# Altium schematic sheet STM32L152.SchDoc
size A4
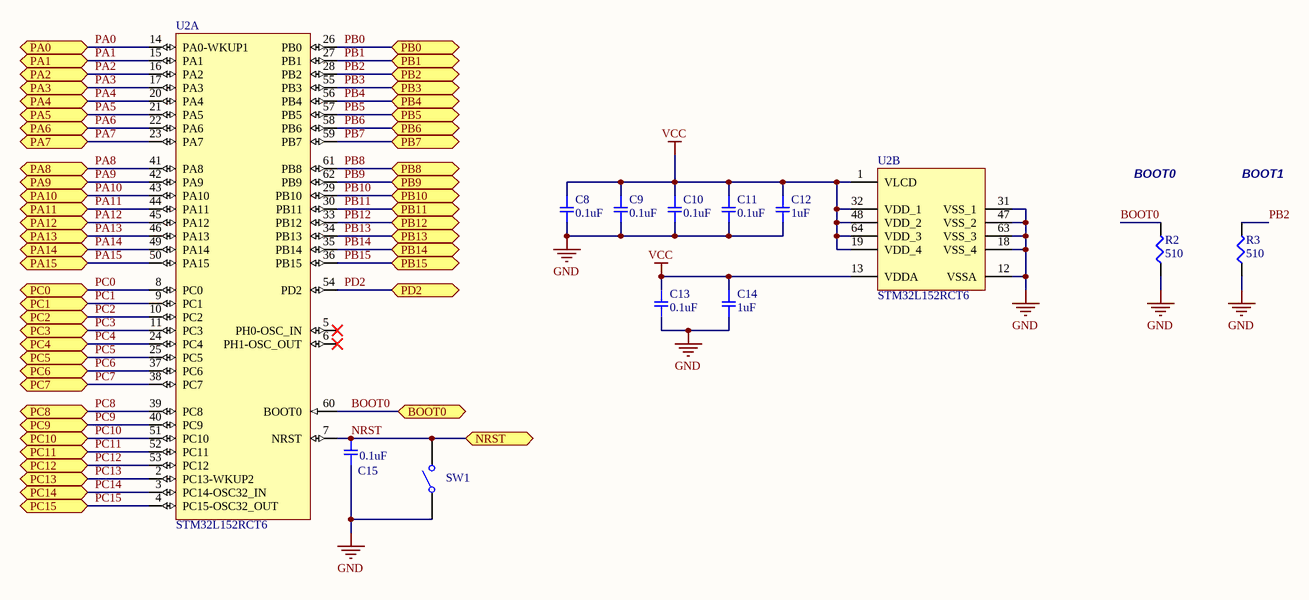
[diagram p0: STM32L152.SchDoc]

## Parts
C8  0.1uF  [SMD-0805C]
C9  0.1uF  [SMD-0805C]
C10  0.1uF  [SMD-0805C]
C11  0.1uF  [SMD-0805C]
C12  1uF  [SMD-0805C]
C13  0.1uF  [SMD-0805C]
C14  1uF  [SMD-0805C]
C15  0.1uF  [SMD-0805C]
R2  510  [SMD-0805-RES]
R3  510  [SMD-0805-RES]
SW1  Switch_Tact  [Switch_Tact]  (value not drawn)
U2  STM32L152RCT6  [STM-LQFP64_L]  (parts A,B of 2)

## Ports
BOOT0, NRST, PA0, PA1, PA2, PA3, PA4, PA5, PA6, PA7, PA8, PA9, PA10, PA11, PA12, PA13, PA14, PA15, PB0, PB1, PB2, PB3, PB4, PB5, PB6, PB7, PB8, PB9, PB10, PB11, PB12, PB13, PB14, PB15, PC0, PC1, PC2, PC3, PC4, PC5, PC6, PC7, PC8, PC9, PC10, PC11, PC12, PC13, PC14, PC15, PD2

## Nets
GND: C8.2 C9.2 C10.2 C11.2 C12.2 C13.2 C14.2 C15.2 R2.1 R3.1 SW1.1 U2.12(VSSA) U2.18(VSS_4) U2.31(VSS_1) U2.47(VSS_2) U2.63(VSS_3)
VCC: C8.1 C9.1 C10.1 C11.1 C12.1 C13.1 C14.1 U2.1(VLCD) U2.13(VDDA) U2.19(VDD_4) U2.32(VDD_1) U2.48(VDD_2) U2.64(VDD_3)
BOOT0: R2.2 U2.60(BOOT0) ; port BOOT0
NRST: C15.1 SW1.2 U2.7(NRST) ; port NRST
PA0: U2.14(PA0-WKUP1) ; port PA0
PA1: U2.15(PA1) ; port PA1
PA2: U2.16(PA2) ; port PA2
PA3: U2.17(PA3) ; port PA3
PA4: U2.20(PA4) ; port PA4
PA5: U2.21(PA5) ; port PA5
PA6: U2.22(PA6) ; port PA6
PA7: U2.23(PA7) ; port PA7
PA8: U2.41(PA8) ; port PA8
PA9: U2.42(PA9) ; port PA9
PA10: U2.43(PA10) ; port PA10
PA11: U2.44(PA11) ; port PA11
PA12: U2.45(PA12) ; port PA12
PA13: U2.46(PA13) ; port PA13
PA14: U2.49(PA14) ; port PA14
PA15: U2.50(PA15) ; port PA15
PB0: U2.26(PB0) ; port PB0
PB1: U2.27(PB1) ; port PB1
PB2: R3.2 U2.28(PB2) ; port PB2
PB3: U2.55(PB3) ; port PB3
PB4: U2.56(PB4) ; port PB4
PB5: U2.57(PB5) ; port PB5
PB6: U2.58(PB6) ; port PB6
PB7: U2.59(PB7) ; port PB7
PB8: U2.61(PB8) ; port PB8
PB9: U2.62(PB9) ; port PB9
PB10: U2.29(PB10) ; port PB10
PB11: U2.30(PB11) ; port PB11
PB12: U2.33(PB12) ; port PB12
PB13: U2.34(PB13) ; port PB13
PB14: U2.35(PB14) ; port PB14
PB15: U2.36(PB15) ; port PB15
PC0: U2.8(PC0) ; port PC0
PC1: U2.9(PC1) ; port PC1
PC2: U2.10(PC2) ; port PC2
PC3: U2.11(PC3) ; port PC3
PC4: U2.24(PC4) ; port PC4
PC5: U2.25(PC5) ; port PC5
PC6: U2.37(PC6) ; port PC6
PC7: U2.38(PC7) ; port PC7
PC8: U2.39(PC8) ; port PC8
PC9: U2.40(PC9) ; port PC9
PC10: U2.51(PC10) ; port PC10
PC11: U2.52(PC11) ; port PC11
PC12: U2.53(PC12) ; port PC12
PC13: U2.2(PC13-WKUP2) ; port PC13
PC14: U2.3(PC14-OSC32_IN) ; port PC14
PC15: U2.4(PC15-OSC32_OUT) ; port PC15
PD2: U2.54(PD2) ; port PD2

Not connected (* = marked no-connect by the designer): U2 5(PH0-OSC_IN)* 6(PH1-OSC_OUT)*

## Notes on the sheet
- BOOT0
- BOOT1

## Library data of the parts
C8-C11 C13 C15 = CL21B104JBCNNNC: CAP CER 0.1uF 50V X7T 0805; Part Number: GC321AD72E103KX01D; Manufacturer: Samsung Electro-Mechanics; Tolerance: 5%; Package / Case: 0805; Voltage: 50V; VALUE: 0.1uF
C12 C14 = CL21B105KOFNNNG: CAP CER 1uF 16V X7T 0805; Manufacturer: Samsung Electro-Mechanics; Tolerance: 10%; Part Number: CL21B105KOFNNNG; Package / Case: 0805; Voltage: 16V; VALUE: 1uF
R2 R3 = ERJ-6GEYJ511V: RES SMD 510 OHM 5% 1/8W 0805; Manufacturer: Panasonic Electronic Components; Factory Stock: 0; Unit Price (USD): 0.00496; @ qty: 1500; Minimum Quantity: 1; Power (Watts): 0.125W, 1/8W; Temperature Coefficient: ±200ppm/°C; Part Number: ERJ-6GEYJ511V; Datasheets: http://industrial.panasonic.com/www-cgi/jvcr13pz.cgi?E+PZ+3+AOA0001+ERJ6GEYJ511V+7+WW; Image: //media.digikey.com/Renders/Panasonic%20Renders/ERJ-0805%20Pkg.jpg; Digi-Key Part Number: P510ACT-ND; Quantity Available: 116915; Packaging: Cut Tape (CT); Series: ERJ; Part Status: Active; Value: 510; Tolerance: ±5%; Composition: Thick Film; Features: Automotive AEC-Q200; Operating Temperature: -55°C ~ 155°C; Package / Case: 0805 (2012 Metric); Supplier Device Package: 0805; Size / Dimension: 0.079" L x 0.049" W (2.00mm x 1.25mm); Height - Seated (Max): 0.028" (0.70mm); Number of Terminations: 2; Failure Rate: -
SW1 = Switch_Tact: WS-TASV SMD Tact Switch 6.0X3.5 mm; PartNumber: 434121050836; NoPins: 04; PackageReference: 434121050836; ComponentLink1Description: Manufacturer URL; ComponentLink1URL: http://www.we-online.com; ComponentLink2Description: Datasheet; ComponentLink2URL: http://katalog.we-online.de/em/datasheet/434121050836.pdf
U2 = STM32L152RCT6: ARM Cortex-M3 32-bit MCU, 256 KB Flash, 32 KB Internal RAM, 51 I/Os, 64-pin LQFP, -40 to 85 degC, Tray; Manufacturer: STMicroelectronics; D/A Converter: 2x12-bit (2 Channel); Data E2PROM nom (B): 8192; Display controller: LCD 4x32/8x28; FLASH Size (Prog) (kB): 256; I/Os (High Current): 51; Internal RAM Size (kB): 32; Supply Voltage(Vcc) min (V): 1.65; DatasheetVersion: Rev. 3; PackageVersion: Rev. 4, 06/2013; PackageReference: LQFP64; PackageDescription: 64-Pin Low Profile Quad Flat Package, 10 x 10 mm Body, 0.5 mm Pitch; Core: ARM Cortex-M3; Operating Frequency(F) (Processor speed) (MHz): 32; Packing: Tray; Mounting Technology: Surface Mount; PartNumber: STM32L152RCT6; ComponentLink1Description: Manufacturer URL; ComponentLink1URL: http://www.st.com/web/en/home.html; ComponentLink2Description: Datasheet; ComponentLink2URL: http://www.st.com/st-web-ui/static/active/en/resource/technical/document/datasheet/DM00048356.pdf; ComponentLink3Description: Package Specification; ComponentLink3URL: http://www.st.com/st-web-ui/static/active/en/resource/technical/document/datasheet/DM00037051.pdf